# EAGLE design dac (EAGLE 9.6.2)
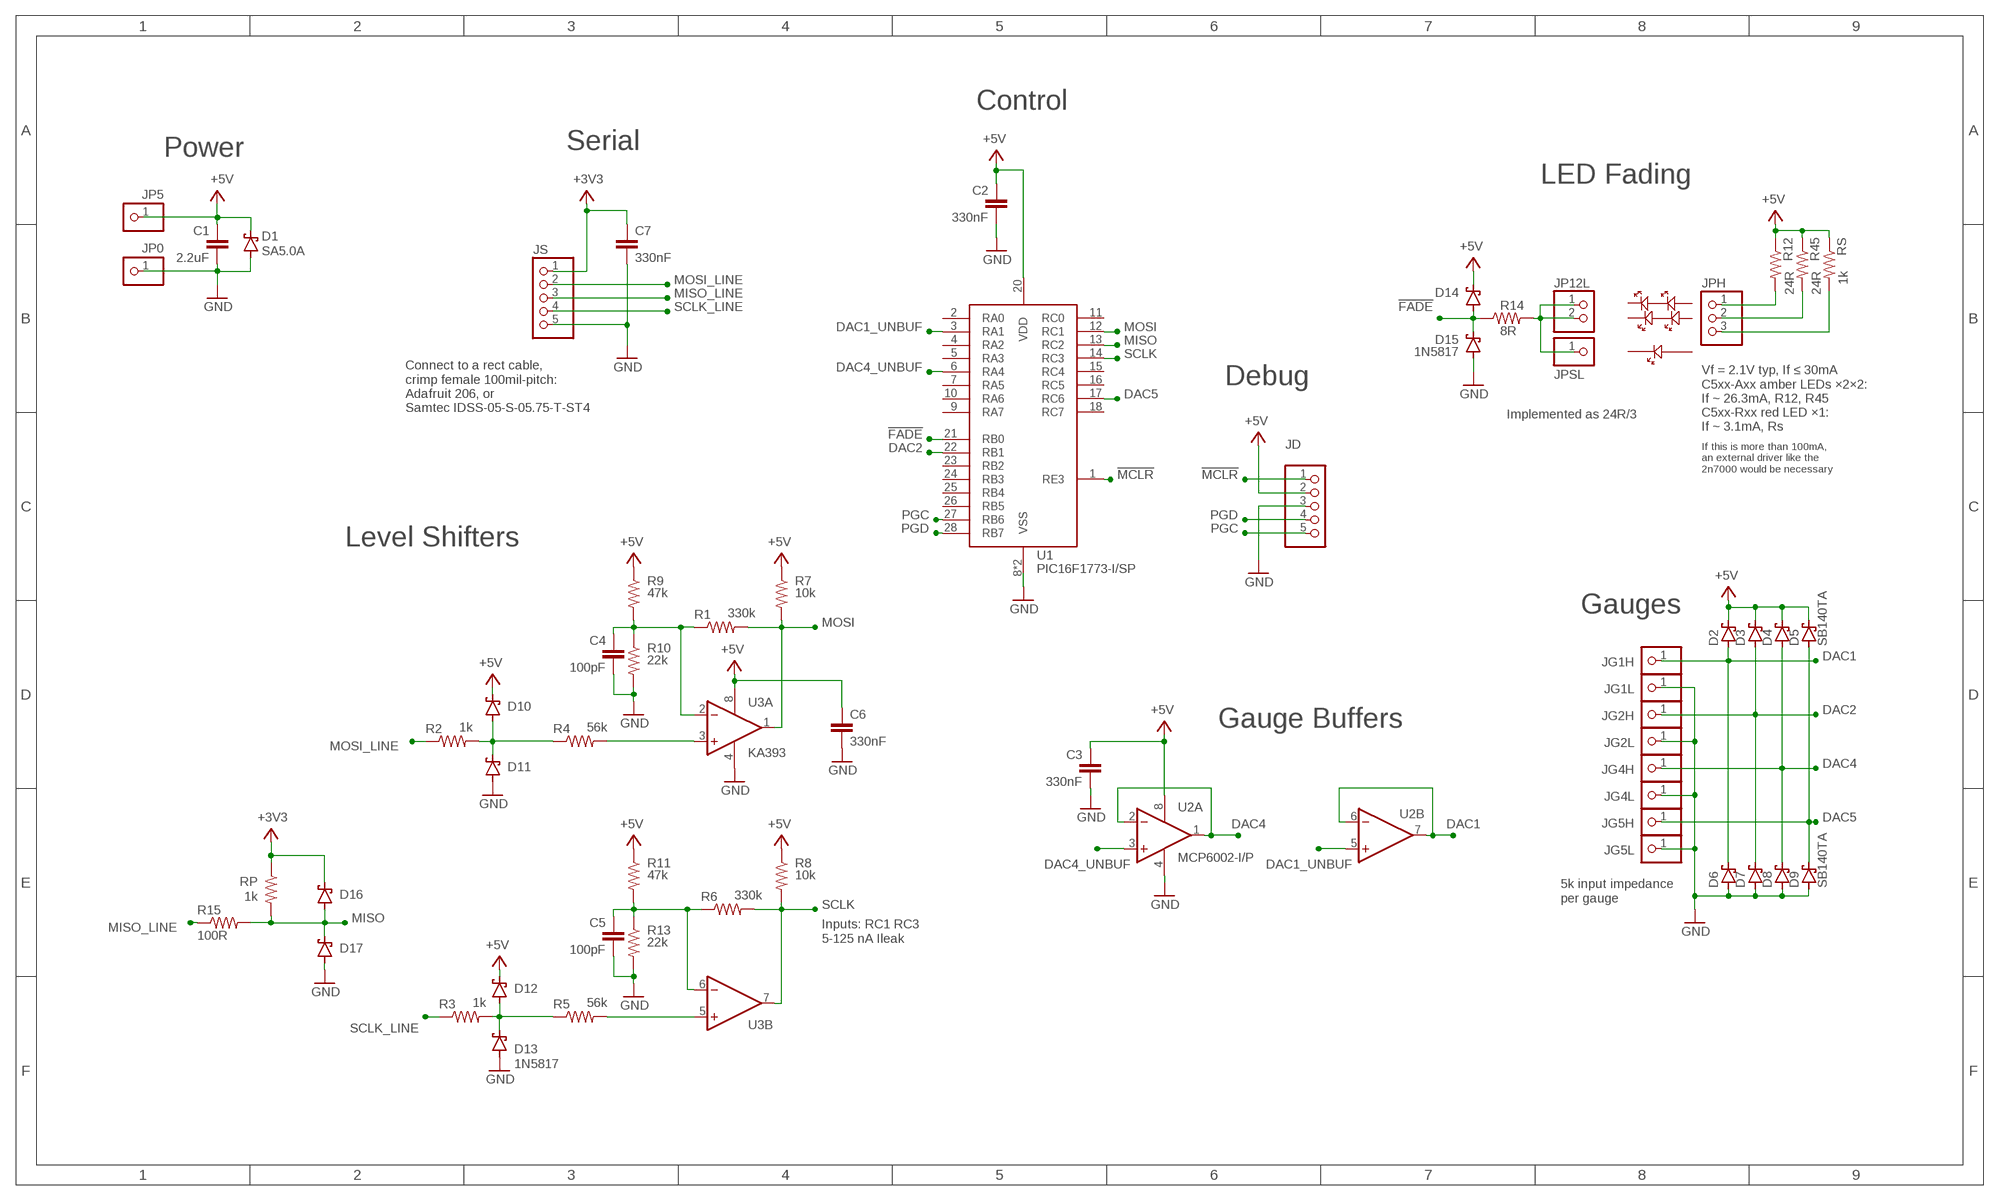
[diagram p0: schematic, sheet 1]

## Parts
C1  2.2uF  C-EU050-024X044  [C050-024X044]
C2  330nF  C-EU050-024X044  [C050-024X044]
C3  330nF  C-EU050-024X044  [C050-024X044]
C4  100pF  C-EU050-024X044  [C050-024X044]
C5  100pF  C-EU050-024X044  [C050-024X044]
C6  330nF  C-EU050-024X044  [C050-024X044]
C7  330nF  C-EU050-024X044  [C050-024X044]
D1  SA5.0A  SB120-V  [ZDIO-2.5]
D2  SB140TA  SB140  [DO41-7.6]
D3  SB140TA  SB140  [DO41-7.6]
D4  SB140TA  SB140  [DO41-7.6]
D5  SB140TA  SB140  [DO41-7.6]
D6  SB140TA  SB140  [DO41-7.6]
D7  SB140TA  1N5817-B  [DO41-7.6]
D8  SB140TA  1N5817-B  [DO41-7.6]
D9  SB140TA  1N5817-B  [DO41-7.6]
D10  1N5817-H76  [DO41-7.6]
D11  1N5817-V  [ZDIO-2.5]
D12  1N5817-T  [DO41-7.6]
D13  1N5817  1N5817-H10  [DO41-10]
D14  1N5817  SB140-V  [ZDIO-2.5]
D15  1N5817  SB140-V  [ZDIO-2.5]
D16  1N5817-T  [DO41-7.6]
D17  1N5817-T  [DO41-7.6]
JD  PINHD-1X5  [1X05]
JG1H  PINHD-1X1  [1X01]
JG1L  PINHD-1X1  [1X01]
JG2H  PINHD-1X1  [1X01]
JG2L  PINHD-1X1  [1X01]
JG4H  PINHD-1X1  [1X01]
JG4L  PINHD-1X1  [1X01]
JG5H  PINHD-1X1  [1X01]
JG5L  PINHD-1X1  [1X01]
JP0  PINHD-1X1  [1X01]
JP5  PINHD-1X1  [1X01]
JP12L  PINHD-1X2  [1X02]
JPH  PINHD-1X3  [1X03]
JPSL  PINHD-1X1  [1X01]
JS  PINHD-1X5  [1X05]
R1  330k  R-US_0207/2V  [0207/2V]
R2  1k  R-US_0204/7  [0204/7]
R3  1k  R-US_0207/10  [0207/10]
R4  56k  R-US_0207/10  [0207/10]
R5  56k  R-US_0207/12  [0207/12]
R6  330k  R-US_0207/2V  [0207/2V]
R7  10k  R-US_0207/2V  [0207/2V]
R8  10k  R-US_0207/2V  [0207/2V]
R9  47k  R-US_0207/7  [0207/7]
R10  22k  R-US_0207/5V  [0207/5V]
R11  47k  R-US_0207/5V  [0207/5V]
R12  24R  R-US_0207/2V  [0207/2V]
R13  22k  R-US_0207/5V  [0207/5V]
R14  8R  R-US_0207/15  [0207/15]
R15  100R  R-US_0207/10  [0207/10]
R45  24R  R-US_0207/2V  [0207/2V]
RP  1k  R-US_0207/5V  [0207/5V]
RS  1k  R-US_0207/2V  [0207/2V]
U1  PIC16F1773-I/SP  [DIL28-3]
U2  MCP6002-I/P  MCP602P  [DIL08]
U3  KA393  LM393N  [DIL08]

## Nets
!FADE: D14.A D15.C R14.1 U1.21(RB0)
!FADE_PROT: JP12L.1 JP12L.2 JPSL.1 R14.2
!MCLR: JD.1 U1.1(RE3)
+3V3 [power]: C7.1 D16.C JS.1 RP.1
+5V [power]: C1.1 C2.1 C3.1 C6.1 D1.C D2.C D3.C D4.C D5.C D10.C D12.C D14.C JD.2 JP5.1 R7.1 R8.1 R9.1 R11.1 R12.1 R45.1 RS.1 U1.20(VDD) U2.8(P:V+) U3.8(P:V+)
DAC1: D2.A D6.C JG1H.1 U2.6(B:-IN) U2.7(B:OUT)
DAC1_UNBUF: U1.3(RA1) U2.5(B:+IN)
DAC2: D3.A D7.C JG2H.1 U1.22(RB1)
DAC4: D4.A D8.C JG4H.1 U2.1(A:OUT) U2.2(A:-IN)
DAC4_UNBUF: U1.6(RA4) U2.3(A:+IN)
DAC5: D5.A D9.C JG5H.1 U1.17(RC6)
GND [power]: C1.2 C2.2 C3.2 C4.2 C5.2 C6.2 C7.2 D1.A D6.A D7.A D8.A D9.A D11.A D13.A D15.A D17.A JD.3 JG1L.1 JG2L.1 JG4L.1 JG5L.1 JP0.1 JS.5 R10.2 R13.2 U1.8(VSS) U1.19(VSS) U2.4(P:V-) U3.4(P:V-)
LED1: JPH.1 R12.2
LED2: JPH.2 R45.2
LEDSUP: JPH.3 RS.2
MISO: D16.A D17.C R15.2 RP.2 U1.13(RC2)
MISO_LINE: JS.3 R15.1
MOSI: R1.2 R7.2 U1.12(RC1) U3.1(A:OUT)
MOSI_LINE: JS.2 R2.1
MOSI_N: C4.1 R1.1 R9.2 R10.1 U3.2(A:-IN)
MOSI_P: R4.2 U3.3(A:+IN)
MOSI_PROT: D10.A D11.C R2.2 R4.1
PGC: JD.5 U1.27(RB6)
PGD: JD.4 U1.28(RB7)
SCLK: R6.2 R8.2 U1.14(RC3) U3.7(B:OUT)
SCLK_LINE: JS.4 R3.1
SCLK_N: C5.1 R6.1 R11.2 R13.1 U3.6(B:-IN)
SCLK_P: R5.2 U3.5(B:+IN)
SCLK_PROT: D12.A D13.C R3.2 R5.1
Unconnected: U1.2(RA0) U1.4(RA2) U1.5(RA3) U1.7(RA5) U1.9(RA7) U1.10(RA6) U1.11(RC0) U1.15(RC4) U1.16(RC5) U1.18(RC7) U1.23(RB2) U1.24(RB3) U1.25(RB4) U1.26(RB5)

## Notes on the sheet
- Control
- Power | Serial
- LED Fading
- Vf = 2.1V typ, If ≤ 30mA
  C5xx-Axx amber LEDs ×2×2:
  If ~ 26.3mA, R12, R45
  C5xx-Rxx red LED ×1:
  If ~ 3.1mA, Rs
- Debug
- Connect to a rect cable,
  crimp female 100mil-pitch:
  Adafruit 206, or
  Samtec IDSS-05-S-05.75-T-ST4
- Implemented as 24R/3
- If this is more than 100mA,
  an external driver like the
  2n7000 would be necessary
- Level Shifters
- Gauges
- Gauge Buffers
- 5k input impedance
  per gauge
- Inputs: RC1 RC3
  5-125 nA Ileak

## Library data of the parts
C1-C7 = rcl:C-EU: CAPACITOR, European symbol; SPICEPREFIX: C
D1-D6 D14 D15 = diode-vertical:SB: 1.0A SCHOTTKY BARRIER RECTIFIER Source: http://www.diodes.com/datasheets/ds23001.pdf
D7-D9 D12 D16 D17 = diode:1N581*: 1.0A SCHOTTKY BARRIER RECTIFIER Source: http://www.diodes.com/datasheets/ds23001.pdf
D10 D11 D13 = diode-vertical:1N581
JD JS = pinhead:PINHD-1X5: PIN HEADER
JG1H JG1L JG2H JG2L JG4H JG4L JG5H JG5L JP0 JP5 JPSL = pinhead:PINHD-1X1: PIN HEADER
JP12L = pinhead:PINHD-1X2: PIN HEADER
JPH = pinhead:PINHD-1X3: PIN HEADER
R1-R15 R45 RP RS = rcl:R-US_: RESISTOR, American symbol; SPICEPREFIX: R
U1 = microchip-others:PIC16F177: PIC16(L)F1773/6 28-Pin, 8-Bit Flash Microcontroller PIC16(L)F1773/6 microcontrollers feature a high level of integration of intelligent analog and digital peripherals for a wide range of applications, such as lighting, power supplies, battery charging, motor control and other general purpose applications. These devices deliver multiple op amps, 5-/10-bit DACs, high-speed comparators, 10-bit ADC, 10-/16-bit PWMs, programmable ramp generator (PRG) and other peripherals that can be connected internally to create closed-loop systems without using pins or the printed circuit board (PCB) area. The 10-/16-bit PWMs, digital signal modulators and tri-state output op amp can be used together to create a LED dimming engine for lighting applications. The peripheral pin select (PPS) functionality provides flexibility, eases PCB layout and peripheral utilization by allowing digital peripheral pin mapping to an I/O.
U2 = linear:MCP602: Single Op Amp 2.7V to 6.0V Single Supply CMOS Source: http://ww1.microchip.com/downloads/en/DeviceDoc/21314g.pdf
U3 = linear:LM393: COMPARATOR

## Board
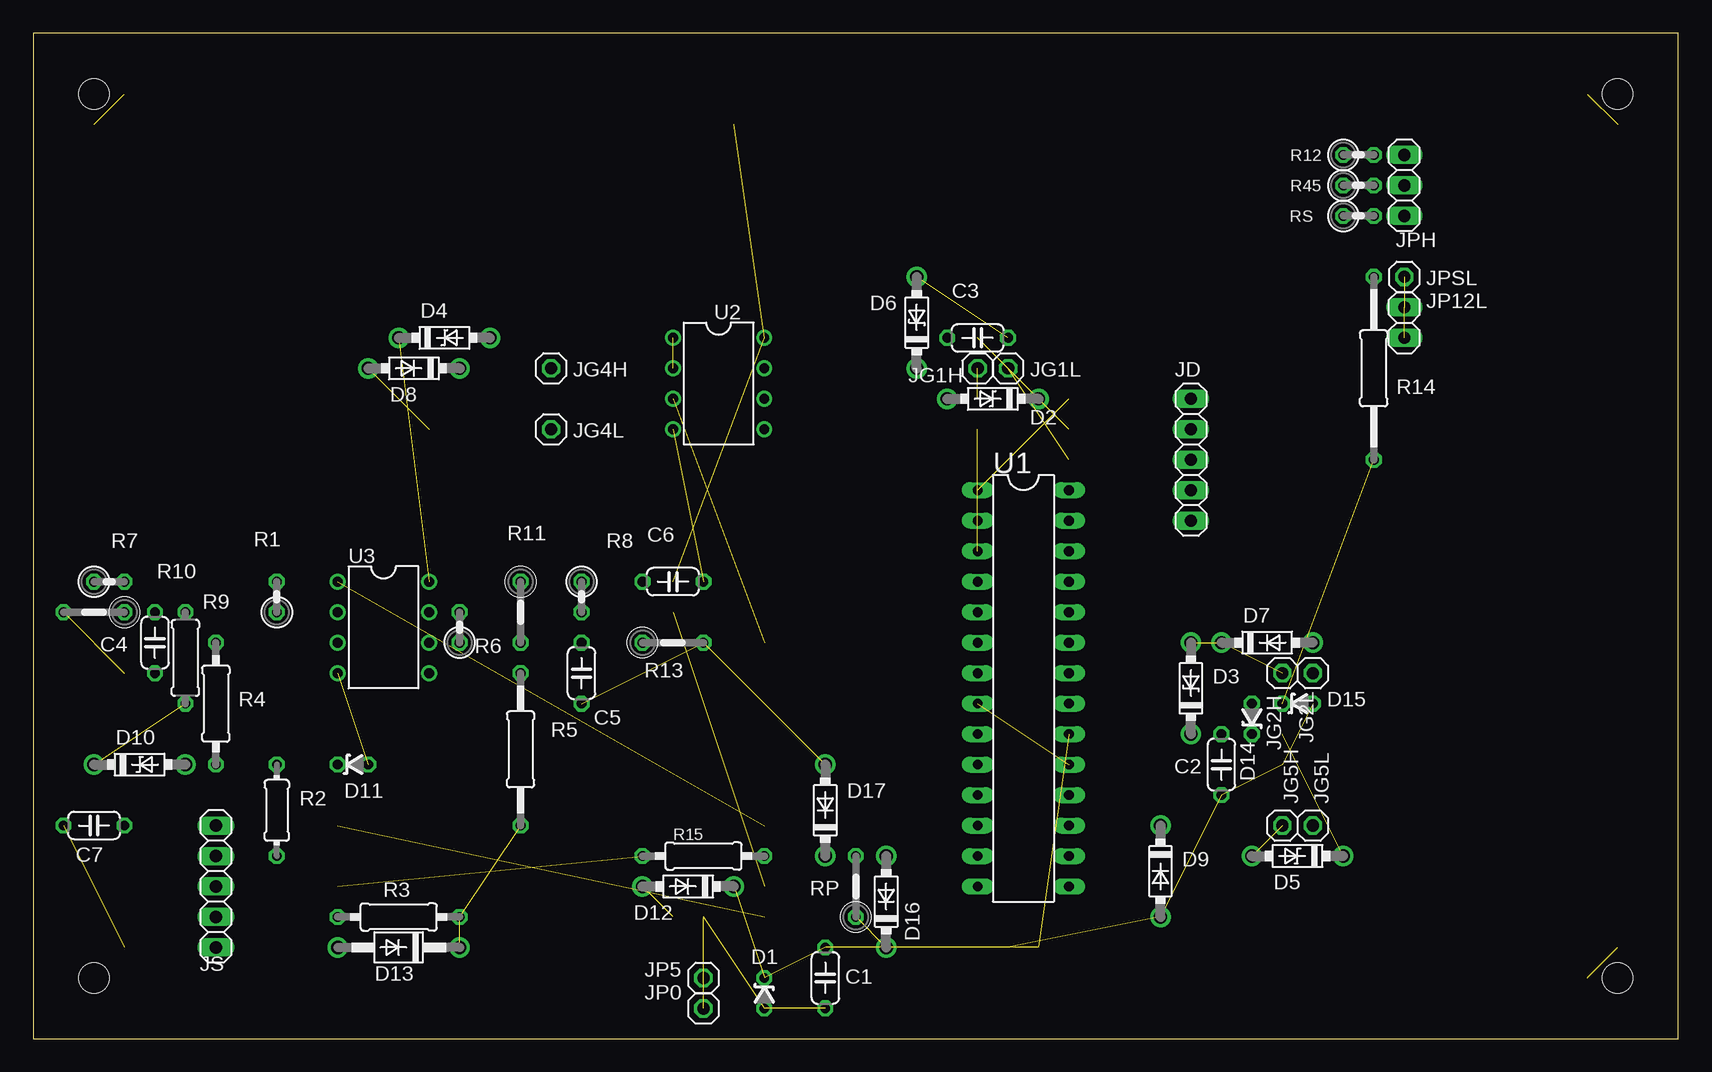
[diagram p1: board, top side]
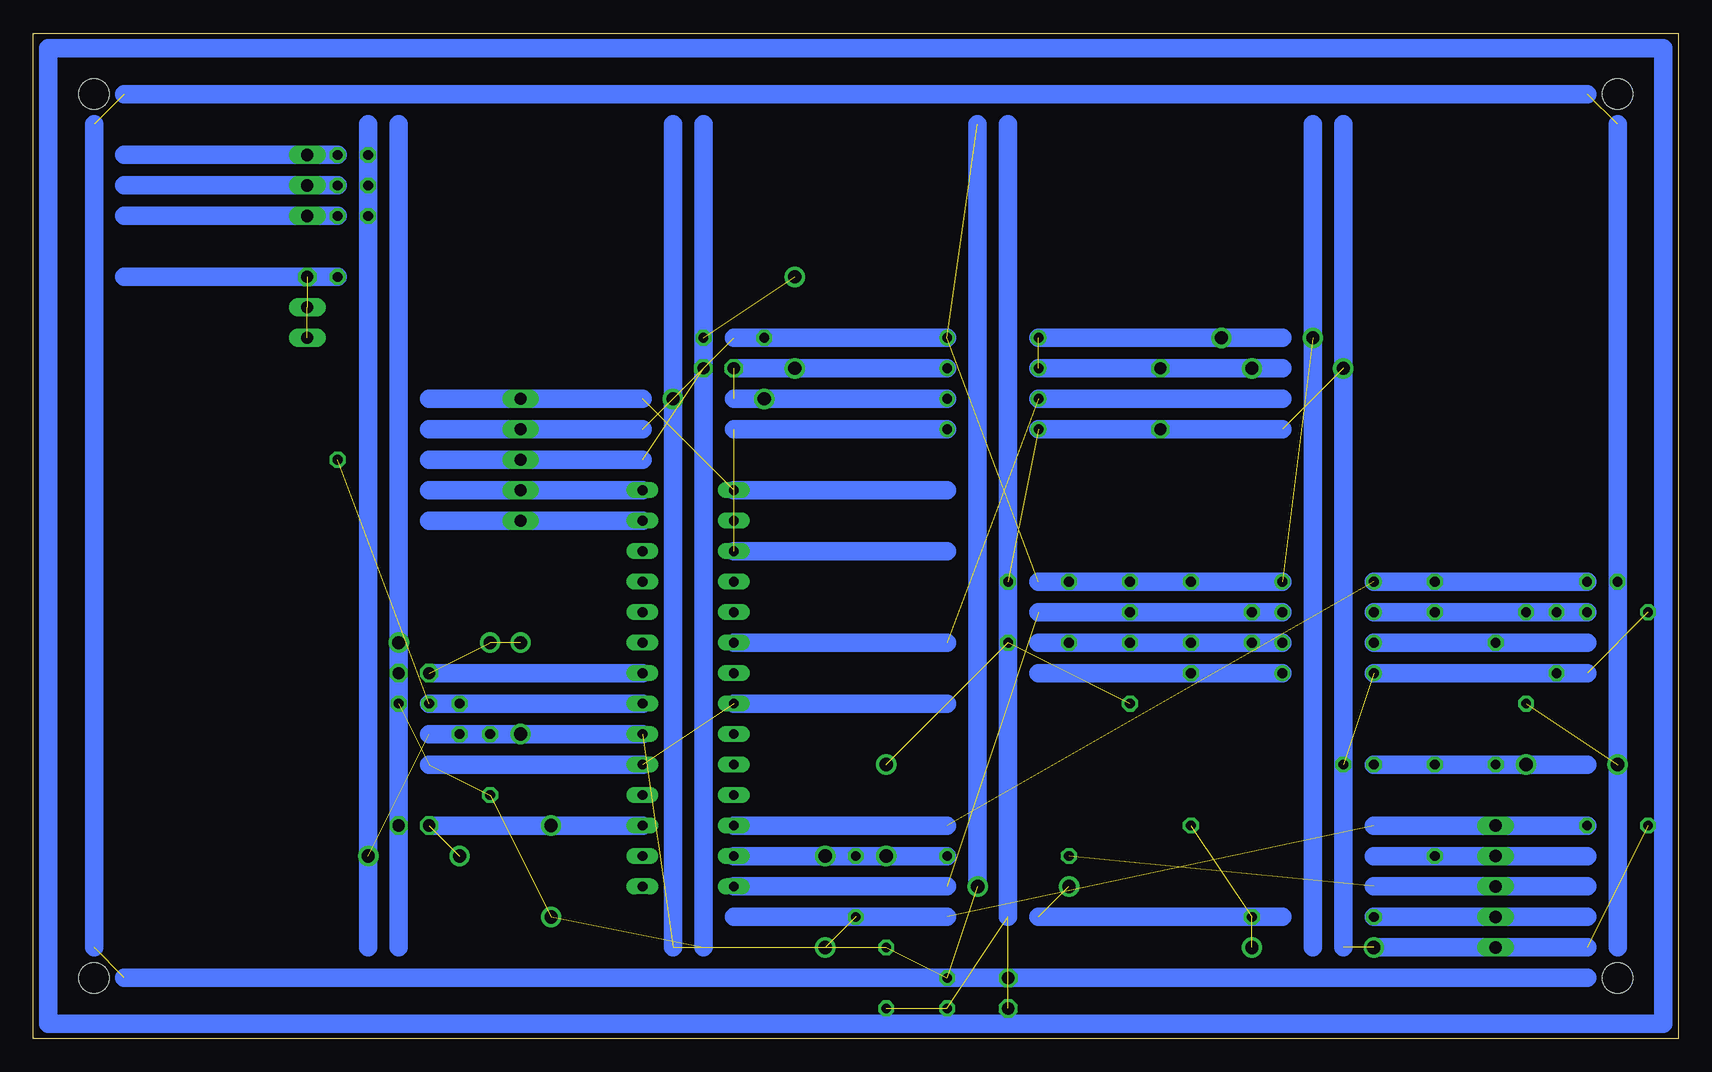
[diagram p2: board, bottom side, seen from below]

Size 137.16 x 83.82 mm. Coordinates in mm from the lower left corner, seen from the top.
Outline: 0,0 137.16,0 137.16,83.82 0,83.82 0,0
Copper layers (1*16): Top 0.035mm / dielectric 1.5mm / Bottom 0.035mm
Design rules "default *": minimum track width 4mil, minimum drill 0.35mm, track to track 6mil, track to pad 6mil, pad to pad 6mil, via to via 6mil, smd to smd 6mil, copper to edge 20mil, drill to drill 6mil, minimum pad ring 10mil, minimum via ring 8mil, stop-mask expansion 4mil, vias tented up to drill 0mil, thermal gap 10mil
Holes 2.54 mm at 5.08,78.74 132.08,78.74 132.08,5.08 5.08,5.08

### Footprints (pad centres in the part's own frame; a part is rotated, then mirrored left to right if it is on the bottom)
C050-024X044 = drill 0.813 octagon: 1 -2.54,0; 2 2.54,0
ZDIO-2.5 = drill 0.813 octagon: A 1.27,0; C -1.27,0
DO41-7.6 = drill 1.1 pad 1.7: A 3.81,0; C -3.81,0
DO41-10 = drill 1.118: A 5.08,0; C -5.08,0
1X05 = drill 1.016 long: 1 -5.08,0; 2 -2.54,0; 3 0,0; 4 2.54,0; 5 5.08,0
1X01 = drill 1.016 octagon: 1 0,0
1X02 = drill 1.016 long: 1 -1.27,0; 2 1.27,0
1X03 = drill 1.016 long: 1 -2.54,0; 2 0,0; 3 2.54,0
0207/2V = drill 0.813 octagon: 1 -1.27,0; 2 1.27,0
0204/7 = drill 0.813 octagon: 1 -3.81,0; 2 3.81,0
0207/10 = drill 0.813 octagon: 1 -5.08,0; 2 5.08,0
0207/12 = drill 0.813 octagon: 1 -6.35,0; 2 6.35,0
0207/7 = drill 0.813 octagon: 1 -3.81,0; 2 3.81,0
0207/5V = drill 0.813 octagon: 1 -2.54,0; 2 2.54,0
0207/15 = drill 0.813 octagon: 1 -7.62,0; 2 7.62,0
DIL28-3 = drill 0.813 long: 1 -16.51,-3.81; 2 -13.97,-3.81; 3 -11.43,-3.81; 4 -8.89,-3.81; 5 -6.35,-3.81; 6 -3.81,-3.81; 7 -1.27,-3.81; 8 1.27,-3.81; 9 3.81,-3.81; 10 6.35,-3.81; 11 8.89,-3.81; 12 11.43,-3.81; 13 13.97,-3.81; 14 16.51,-3.81; 15 16.51,3.81; 16 13.97,3.81; 17 11.43,3.81; 18 8.89,3.81; 19 6.35,3.81; 20 3.81,3.81; 21 1.27,3.81; 22 -1.27,3.81; 23 -3.81,3.81; 24 -6.35,3.81; 25 -8.89,3.81; 26 -11.43,3.81; 27 -13.97,3.81; 28 -16.51,3.81
DIL08 = drill 0.813 pad 1.27: 1 -3.81,-3.81; 2 -1.27,-3.81; 3 1.27,-3.81; 4 3.81,-3.81; 5 3.81,3.81; 6 1.27,3.81; 7 -1.27,3.81; 8 -3.81,3.81

### Placement (x,y rotation side)
C1  66.04,5.08 270 top
C2  99.06,22.86 270 top
C3  78.74,58.42 0 top
C4  10.16,33.02 270 top
C5  45.72,30.48 270 top
C6  53.34,38.1 0 top
C7  5.08,17.78 180 top
D1  60.96,3.81 270 top
D2  80.01,53.34 180 top
D3  96.52,29.21 90 top
D4  34.29,58.42 0 top
D5  105.41,15.24 180 top
D6  73.66,59.69 90 top
D7  102.87,33.02 0 top
D8  31.75,55.88 180 top
D9  93.98,13.97 270 top
D10  8.89,22.86 0 top
D11  26.67,22.86 0 top
D12  54.61,12.7 180 top
D13  30.48,7.62 180 top
D14  101.6,26.67 90 top
D15  105.41,27.94 0 top
D16  71.12,11.43 90 top
D17  66.04,19.05 90 top
JD  96.52,48.26 270 top
JG1H  78.74,55.88 0 top
JG1L  81.28,55.88 180 top
JG2H  104.14,30.48 0 top
JG2L  106.68,30.48 0 top
JG4H  43.18,55.88 0 top
JG4L  43.18,50.8 0 top
JG5H  104.14,17.78 0 top
JG5L  106.68,17.78 0 top
JP0  55.88,2.54 0 top
JP5  55.88,5.08 0 top
JP12L  114.3,59.69 90 top
JPH  114.3,71.12 270 top
JPSL  114.3,63.5 0 top
JS  15.24,12.7 270 top
R1  20.32,36.83 90 top
R2  20.32,19.05 90 top
R3  30.48,10.16 0 top
R4  15.24,27.94 90 top
R5  40.64,24.13 90 top
R6  35.56,34.29 90 top
R7  6.35,38.1 0 top
R8  45.72,36.83 270 top
R9  12.7,31.75 90 top
R10  5.08,35.56 180 top
R11  40.64,35.56 270 top
R12  110.49,73.66 0 top
R13  53.34,33.02 0 top
R14  111.76,55.88 90 top
R15  55.88,15.24 0 top
R45  110.49,71.12 0 top
RP  68.58,12.7 90 top
RS  110.49,68.58 0 top
U1  82.55,29.21 270 top
U2  57.15,54.61 270 top
U3  29.21,34.29 270 top

### Tracks (layer width: path | path; a pad name or v marks a point on that pad's centre or on a via)
!FADE  (1 unrouted)
  Bottom 1.524: D15.C D14.A U1.21
!FADE_PROT  (2 unrouted)
  Bottom 1.524: R14.2 JPSL.1 129.54,63.5
!MCLR  (1 unrouted)
  Bottom 1.524: 86.36,53.34 JD.1 104.14,53.34 | U1.1 60.96,45.72
+3V3  (2 unrouted)
  Bottom 1.524: 25.4,17.78 JS.1 C7.1 | 60.96,10.16 RP.1 78.74,10.16
+5V  (14 unrouted)
  Bottom 1.524: 30.48,7.62 D4.C 30.48,76.2 | 7.62,78.74 129.54,78.74 | 132.08,7.62 132.08,76.2 | 129.54,5.08 D1.C JP5.1 7.62,5.08 | D12.C 58.42,76.2 | 83.82,7.62 83.82,76.2 | U2.8 C3.1 78.74,58.42 | 86.36,50.8 JD.2 104.14,50.8 | U1.20 D3.C C2.1 D14.C 104.14,25.4 | 109.22,7.62 D5.C RS.1 R45.1 R12.1 109.22,76.2 | U3.8 R11.1 R8.1 C6.1 53.34,38.1 | 5.08,76.2 R7.1 D10.C 5.08,7.62
DAC1  (1 unrouted)
  Bottom 1.524: U2.7 D6.C JG1H.1 | U2.6 D2.A 78.74,53.34
DAC1_UNBUF  (1 unrouted)
  Bottom 1.524: U1.3 60.96,40.64 | U2.5 78.74,50.8
DAC2  (2 unrouted)
  Bottom 1.524: U1.22 JG2H.1
DAC4  (1 unrouted)
  Bottom 1.524: U2.2 JG4H.1 D8.C 33.02,55.88 | U2.1 D4.A 33.02,58.42
DAC4_UNBUF  (1 unrouted)
  Bottom 1.524: U1.6 60.96,33.02 | U2.3 33.02,53.34
DAC5  (1 unrouted)
  Bottom 1.524: JG5H.1 D9.C U1.17
GND  (19 unrouted)
  Bottom 1.524: 7.62,7.62 JS.5 D13.A | U3.4 C4.2 7.62,30.48 | U2.4 JG4L.1 33.02,50.8 | 27.94,76.2 D8.A D11.A 27.94,7.62 | 86.36,48.26 JD.3 104.14,48.26 | U1.8 60.96,27.94 | 106.68,76.2 D7.A JG2L.1 D15.A JG5L.1 106.68,7.62 | U1.19 104.14,22.86 | 55.88,76.2 C6.2 R13.2 55.88,10.16 | 81.28,7.62 JG1L.1 C3.2 81.28,76.2 | 135.89,1.27 135.89,82.55 1.27,82.55 1.27,1.27 135.89,1.27
LED1
  Bottom 1.524: R12.2 JPH.1 129.54,73.66
LED2
  Bottom 1.524: R45.2 JPH.2 129.54,71.12
LEDSUP
  Bottom 1.524: RS.2 JPH.3 129.54,68.58
MISO
  Bottom 1.524: U1.13 D16.A RP.2 D17.C R15.2
MISO_LINE  (1 unrouted)
  Bottom 1.524: 25.4,12.7 JS.3 7.62,12.7
MOSI  (1 unrouted)
  Bottom 1.524: R7.2 R1.2 U3.1 | U1.12 60.96,17.78
MOSI_LINE
  Bottom 1.524: 25.4,15.24 R2.1 JS.2 7.62,15.24
MOSI_N
  Bottom 1.524: U3.2 R1.1 R9.2 C4.1 R10.1
MOSI_P
  Bottom 1.524: U3.3 R4.2 7.62,33.02
MOSI_PROT
  Bottom 1.524: D11.C R2.2 R4.1 D10.A 7.62,22.86
PGC
  Bottom 1.524: U1.27 JD.5 104.14,43.18
PGD
  Bottom 1.524: 104.14,45.72 JD.4 U1.28
SCLK  (1 unrouted)
  Bottom 1.524: U3.7 R6.2 R8.2 53.34,35.56 | U1.14 60.96,12.7
SCLK_LINE
  Bottom 1.524: 7.62,10.16 JS.4 R3.1
SCLK_N
  Bottom 1.524: U3.6 R6.1 R11.2 C5.1 R13.1 53.34,33.02
SCLK_P
  Bottom 1.524: U3.5 R5.2 53.34,30.48
SCLK_PROT  (3 unrouted)
  Bottom 1.524: 33.02,10.16 R3.2 53.34,10.16

### Text on the board
bValues: GENERAL-1645-C
Measures: Columns | Rows
tDocu: Move as needed / (Eagle width / limitation) | Move as needed / (Eagle height / limitation)